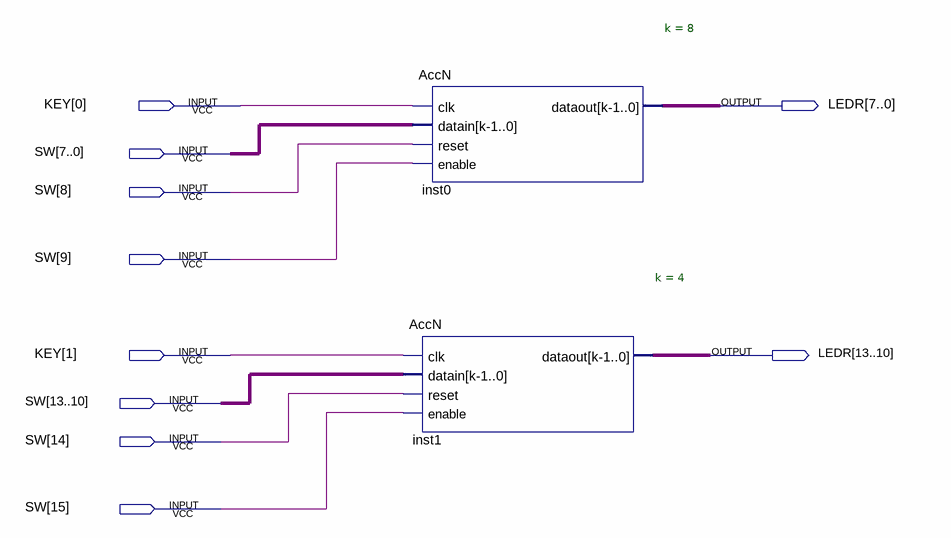
[diagram p0: schematic sheet]
// Quartus schematic AccN_Demo.bdf as structural Verilog: 2 symbols, 10 pins
module AccN_Demo (
  input  [1:0] KEY,
  input  [15:0] SW,
  output [13:0] LEDR
);

  AccN #(.k(8)) inst0 (.clk(KEY[0]), .datain(SW[7:0]), .reset(SW[8]), .enable(SW[9]), .dataout(LEDR[7:0]));
  AccN #(.k(4)) inst1 (.clk(KEY[1]), .datain(SW[13:10]), .reset(SW[14]), .enable(SW[15]), .dataout(LEDR[13:10]));
endmodule
